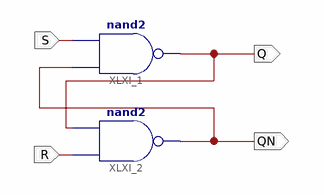
[diagram p0: schematic sheet 1]
// Xilinx ISE schematic SR_LATCH.sch (kintex7) as structural Verilog: 2 symbols, 4 ports
module SR_LATCH (
  input  S,
  input  R,
  output Q,
  output QN
);

  nand XLXI_1 (Q, QN, S);
  nand XLXI_2 (QN, R, Q);
endmodule
